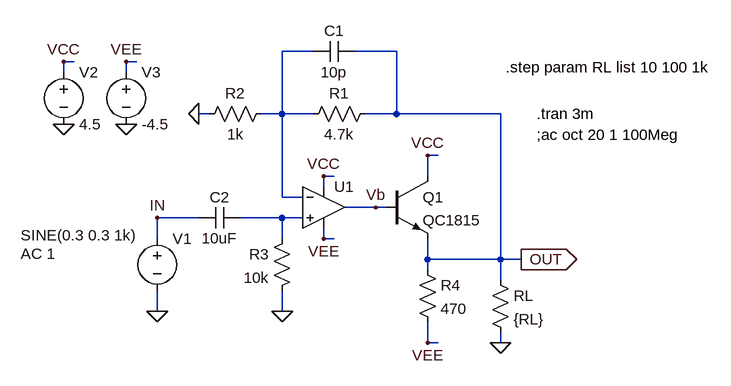
[diagram p0: schematic EmitterFollower+OPAMP_AC_Coupling.asc]
EmitterFollower+OPAMP_AC_Coupling.asc, the LTspice schematic file:
Version 4
SHEET 1 880 680
WIRE 128 -64 80 -64
WIRE 256 -64 192 -64
WIRE -240 -48 -256 -48
WIRE -144 -48 -160 -48
WIRE -256 -32 -256 -48
WIRE -160 -32 -160 -48
WIRE -32 32 -48 32
WIRE 80 32 80 -64
WIRE 80 32 48 32
WIRE 128 32 80 32
WIRE 256 32 256 -64
WIRE 256 32 208 32
WIRE 416 32 256 32
WIRE 320 96 304 96
WIRE 160 128 144 128
WIRE 304 128 304 96
WIRE 144 144 144 128
WIRE 80 160 80 32
WIRE 112 160 80 160
WIRE 224 176 176 176
WIRE 240 176 224 176
WIRE -48 192 -112 192
WIRE 80 192 16 192
WIRE 112 192 80 192
WIRE -112 224 -112 192
WIRE 80 224 80 192
WIRE 144 224 144 208
WIRE 160 224 144 224
WIRE 304 256 304 224
WIRE 416 256 416 32
WIRE 416 256 304 256
WIRE 448 256 416 256
WIRE 304 272 304 256
WIRE 416 288 416 256
WIRE -112 336 -112 304
WIRE 80 336 80 304
WIRE 304 384 304 352
WIRE 320 384 304 384
WIRE 416 384 416 368
FLAG 144 224 VEE
FLAG -48 32 0
FLAG 144 128 VCC
FLAG 304 384 VEE
FLAG 80 336 0
FLAG 448 256 OUT
IOPIN 448 256 Out
FLAG 416 384 0
FLAG -112 336 0
FLAG -112 192 IN
FLAG -256 -48 VCC
FLAG -160 -48 VEE
FLAG -256 48 0
FLAG -160 48 0
FLAG 304 96 VCC
FLAG 224 176 Vb
SYMBOL Opamps\\UniversalOpamp2 144 176 R0
SYMATTR InstName U1
SYMBOL res 64 16 R90
WINDOW 0 0 56 VBottom 2
WINDOW 3 32 56 VTop 2
SYMATTR InstName R2
SYMATTR Value 1k
SYMBOL res 112 48 R270
WINDOW 0 32 56 VTop 2
WINDOW 3 0 56 VBottom 2
SYMATTR InstName R1
SYMATTR Value 4.7k
SYMBOL npn 240 128 R0
SYMATTR InstName Q1
SYMATTR Value QC1815
SYMBOL res 288 256 R0
SYMATTR InstName R4
SYMATTR Value 470
SYMBOL cap 192 -48 M270
WINDOW 0 32 32 VTop 2
WINDOW 3 0 32 VBottom 2
SYMATTR InstName C1
SYMATTR Value 10p
SYMBOL res 96 208 M0
SYMATTR InstName R3
SYMATTR Value 10k
SYMBOL res 400 272 R0
SYMATTR InstName RL
SYMATTR Value {RL}
SYMBOL voltage -112 208 R0
WINDOW 3 -210 11 Left 2
WINDOW 123 -210 39 Left 2
WINDOW 39 0 0 Left 2
SYMATTR Value SINE(0.3 0.3 1k)
SYMATTR Value2 AC 1
SYMATTR InstName V1
SYMBOL voltage -256 -48 R0
WINDOW 123 0 0 Left 2
WINDOW 39 0 0 Left 2
SYMATTR InstName V2
SYMATTR Value 4.5
SYMBOL voltage -160 -48 R0
WINDOW 123 0 0 Left 2
WINDOW 39 0 0 Left 2
SYMATTR InstName V3
SYMATTR Value -4.5
SYMBOL cap 16 176 R90
WINDOW 0 0 32 VBottom 2
WINDOW 3 32 32 VTop 2
SYMATTR InstName C2
SYMATTR Value 10uF
TEXT 424 -40 Left 2 !.step param RL list 10 100 1k
TEXT 472 32 Left 2 !.tran 3m
TEXT 472 64 Left 2 !;ac oct 20 1 100Meg

The netlist it stands for:
* EmitterFollower+OPAMP_AC_Coupling.asc
XU1 N002 N001 VCC VEE Vb level.2 Avol=1Meg GBW=10Meg Slew=10Meg ilimit=25m rail=0 Vos=0 phimargin=45 en=0 enk=0 in=0 ink=0 Rin=500Meg  ; pins IN+ IN- V+ V- OUT
R2 N001 0 1k
R1 N001 OUT 4.7k
Q1 VCC Vb OUT 0 QC1815
R4 OUT VEE 470
C1 OUT N001 10p
R3 N002 0 10k
RL OUT 0 {RL}
V1 IN 0 SINE(0.3 0.3 1k) AC 1
V2 VCC 0 4.5
V3 VEE 0 -4.5
C2 N002 IN 10uF
.model NPN NPN
.model PNP PNP
.lib standard.bjt
.step param RL list 10 100 1k
.tran 3m
;ac oct 20 1 100Meg
.lib UniversalOpamps2.sub
.backanno
.end